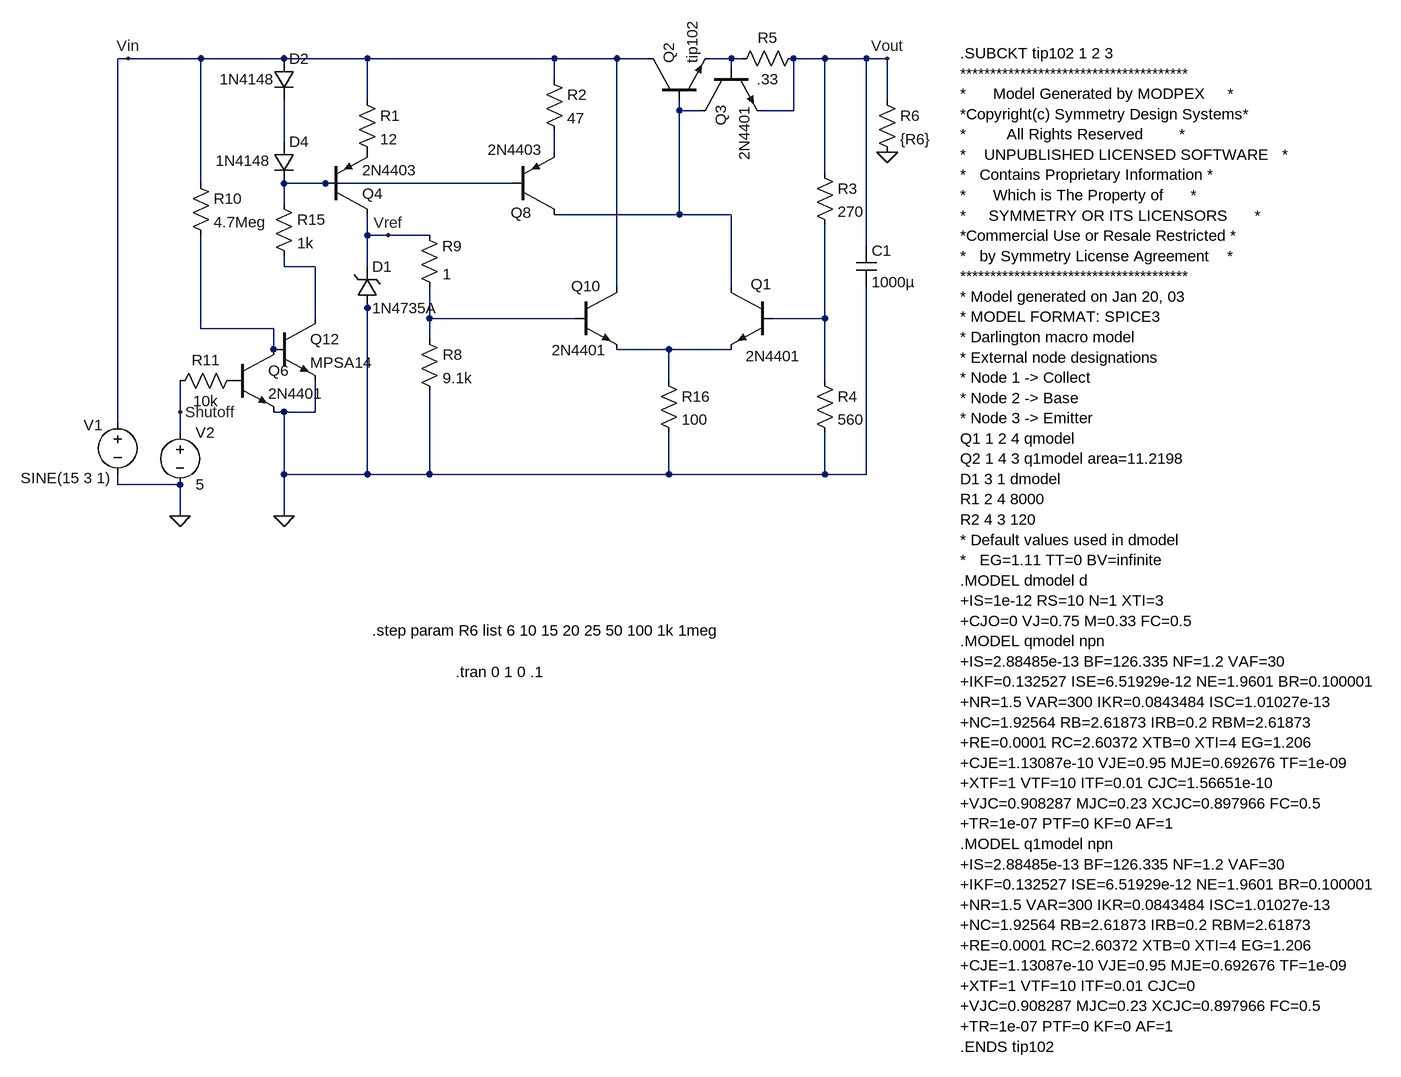
[diagram p0: schematic LPS.asc]
LPS.asc, the LTspice schematic file:
Version 4
SHEET 1 2016 1524
WIRE -640 -48 -656 -48
WIRE -528 -48 -640 -48
WIRE -400 -48 -528 -48
WIRE -272 -48 -400 -48
WIRE 16 -48 -272 -48
WIRE 112 -48 16 -48
WIRE 160 -48 112 -48
WIRE 288 -48 256 -48
WIRE 304 -48 288 -48
WIRE 432 -48 384 -48
WIRE 496 -48 432 -48
WIRE 528 -48 496 -48
WIRE 288 -32 288 -48
WIRE 16 -16 16 -48
WIRE -272 16 -272 -48
WIRE 528 16 528 -48
WIRE 208 32 208 16
WIRE 240 32 208 32
WIRE 384 32 384 -48
WIRE 384 32 336 32
WIRE -400 80 -400 16
WIRE 16 96 16 64
WIRE 432 128 432 -48
WIRE -528 144 -528 -48
WIRE -336 144 -400 144
WIRE -48 144 -336 144
WIRE -400 176 -400 144
WIRE 208 192 208 32
WIRE 208 192 16 192
WIRE 288 192 208 192
WIRE -272 224 -272 192
WIRE -240 224 -272 224
WIRE -176 224 -240 224
WIRE 496 240 496 -48
WIRE -400 272 -400 256
WIRE -352 272 -400 272
WIRE -272 272 -272 224
WIRE 112 304 112 -48
WIRE 288 304 288 192
WIRE -272 336 -272 320
WIRE -352 352 -352 272
WIRE -176 352 -176 304
WIRE 48 352 -176 352
WIRE 432 352 432 208
WIRE 432 352 352 352
WIRE -528 368 -528 224
WIRE -416 368 -528 368
WIRE -176 384 -176 352
WIRE -416 400 -416 368
WIRE 192 400 112 400
WIRE 288 400 192 400
WIRE 192 448 192 400
WIRE 432 448 432 352
WIRE -560 496 -560 448
WIRE -400 496 -416 496
WIRE -352 496 -352 448
WIRE -352 496 -400 496
WIRE -656 512 -656 -48
WIRE -560 528 -560 496
WIRE -400 592 -400 496
WIRE -272 592 -272 336
WIRE -272 592 -400 592
WIRE -176 592 -176 464
WIRE -176 592 -272 592
WIRE 192 592 192 528
WIRE 192 592 -176 592
WIRE 432 592 432 528
WIRE 432 592 192 592
WIRE 496 592 496 304
WIRE 496 592 432 592
WIRE -656 608 -656 592
WIRE -560 608 -656 608
WIRE -560 656 -560 608
WIRE -400 656 -400 592
FLAG -640 -48 Vin
FLAG 528 -48 Vout
FLAG -240 224 Vref
FLAG -560 656 0
FLAG 528 96 0
FLAG -400 656 0
FLAG -560 496 Shutoff
SYMBOL zener -288 336 M180
WINDOW 0 24 64 Left 2
WINDOW 3 24 0 Left 2
SYMATTR InstName D1
SYMATTR Value 1N4735A
SYMBOL npn 352 304 M0
WINDOW 0 2 -5 Left 2
WINDOW 3 -43 106 Left 2
SYMATTR InstName Q1
SYMATTR Value 2N4401
SYMBOL res 416 112 R0
SYMATTR InstName R3
SYMATTR Value 270
SYMBOL res 416 432 R0
SYMATTR InstName R4
SYMATTR Value 560
SYMBOL npn 160 16 R270
SYMATTR InstName Q2
SYMATTR Value tip102
SYMATTR Prefix X
SYMBOL voltage -656 496 R0
WINDOW 123 0 0 Left 2
WINDOW 39 0 0 Left 2
WINDOW 0 -52 20 Left 2
WINDOW 3 -149 102 Left 2
SYMATTR InstName V1
SYMATTR Value SINE(15 3 1)
SYMBOL res 400 -64 R90
WINDOW 0 0 56 VBottom 2
WINDOW 3 32 56 VTop 2
SYMATTR InstName R5
SYMATTR Value .33
SYMBOL npn 240 -32 M90
SYMATTR InstName Q3
SYMATTR Value 2N4401
SYMBOL res 512 0 R0
SYMATTR InstName R6
SYMATTR Value {R6}
SYMBOL diode -416 -48 R0
WINDOW 3 -83 32 Left 2
SYMATTR Value 1N4148
SYMATTR InstName D2
SYMBOL diode -416 80 R0
WINDOW 3 -89 29 Left 2
SYMATTR Value 1N4148
SYMATTR InstName D4
SYMBOL pnp -336 192 M180
SYMATTR InstName Q4
SYMATTR Value 2N4403
SYMBOL res -288 0 R0
SYMATTR InstName R1
SYMATTR Value 12
SYMBOL res -192 368 R0
SYMATTR InstName R8
SYMATTR Value 9.1k
SYMBOL res -192 208 R0
WINDOW 0 35 33 Left 2
SYMATTR InstName R9
SYMATTR Value 1
SYMBOL voltage -560 512 R0
WINDOW 123 0 0 Left 2
WINDOW 39 0 0 Left 2
SYMATTR InstName V2
SYMATTR Value 5
SYMBOL pnp -48 192 M180
WINDOW 0 -3 3 Left 2
WINDOW 3 -39 100 Left 2
SYMATTR InstName Q8
SYMATTR Value 2N4403
SYMBOL res 0 -32 R0
SYMATTR InstName R2
SYMATTR Value 47
SYMBOL npn 48 304 R0
WINDOW 0 -6 -2 Left 2
WINDOW 3 -36 97 Left 2
SYMATTR InstName Q10
SYMATTR Value 2N4401
SYMBOL npn -480 400 R0
SYMATTR InstName Q6
SYMATTR Value 2N4401
SYMBOL npn -416 352 R0
SYMATTR InstName Q12
SYMATTR Value MPSA14
SYMBOL res -544 128 R0
SYMATTR InstName R10
SYMATTR Value 4.7Meg
SYMBOL res -464 432 R90
WINDOW 0 0 56 VBottom 2
WINDOW 3 32 56 VTop 2
SYMATTR InstName R11
SYMATTR Value 10k
SYMBOL res -416 160 R0
SYMATTR InstName R15
SYMATTR Value 1k
SYMBOL res 176 432 R0
SYMATTR InstName R16
SYMATTR Value 100
SYMBOL cap 480 240 R0
SYMATTR InstName C1
SYMATTR Value 1000µ
TEXT -136 896 Left 2 !.tran 0 1 0 .1
TEXT 640 -56 Left 2 !.SUBCKT tip102 1 2 3\n**************************************\n*      Model Generated by MODPEX     *\n*Copyright(c) Symmetry Design Systems*\n*         All Rights Reserved        *\n*    UNPUBLISHED LICENSED SOFTWARE   *\n*   Contains Proprietary Information *\n*      Which is The Property of      *\n*     SYMMETRY OR ITS LICENSORS      *\n*Commercial Use or Resale Restricted *\n*   by Symmetry License Agreement    *\n**************************************\n* Model generated on Jan 20, 03\n* MODEL FORMAT: SPICE3\n* Darlington macro model\n* External node designations\n* Node 1 -> Collect\n* Node 2 -> Base\n* Node 3 -> Emitter\nQ1 1 2 4 qmodel\nQ2 1 4 3 q1model area=11.2198\nD1 3 1 dmodel\nR1 2 4 8000\nR2 4 3 120\n* Default values used in dmodel\n*   EG=1.11 TT=0 BV=infinite\n.MODEL dmodel d\n+IS=1e-12 RS=10 N=1 XTI=3\n+CJO=0 VJ=0.75 M=0.33 FC=0.5\n.MODEL qmodel npn\n+IS=2.88485e-13 BF=126.335 NF=1.2 VAF=30\n+IKF=0.132527 ISE=6.51929e-12 NE=1.9601 BR=0.100001\n+NR=1.5 VAR=300 IKR=0.0843484 ISC=1.01027e-13\n+NC=1.92564 RB=2.61873 IRB=0.2 RBM=2.61873\n+RE=0.0001 RC=2.60372 XTB=0 XTI=4 EG=1.206\n+CJE=1.13087e-10 VJE=0.95 MJE=0.692676 TF=1e-09\n+XTF=1 VTF=10 ITF=0.01 CJC=1.56651e-10\n+VJC=0.908287 MJC=0.23 XCJC=0.897966 FC=0.5\n+TR=1e-07 PTF=0 KF=0 AF=1\n.MODEL q1model npn\n+IS=2.88485e-13 BF=126.335 NF=1.2 VAF=30\n+IKF=0.132527 ISE=6.51929e-12 NE=1.9601 BR=0.100001\n+NR=1.5 VAR=300 IKR=0.0843484 ISC=1.01027e-13\n+NC=1.92564 RB=2.61873 IRB=0.2 RBM=2.61873\n+RE=0.0001 RC=2.60372 XTB=0 XTI=4 EG=1.206\n+CJE=1.13087e-10 VJE=0.95 MJE=0.692676 TF=1e-09\n+XTF=1 VTF=10 ITF=0.01 CJC=0\n+VJC=0.908287 MJC=0.23 XCJC=0.897966 FC=0.5\n+TR=1e-07 PTF=0 KF=0 AF=1\n.ENDS tip102
TEXT -264 832 Left 2 !.step param R6 list 6 10 15 20 25 50 100 1k 1meg

The netlist it stands for:
* LPS.asc
D1 0 Vref 1N4735A
Q1 N002 N008 N010 0 2N4401
R3 Vout N008 270
R4 N008 0 560
XQ2 Vin N002 N001 tip102  ; pins C B E
V1 Vin 0 SINE(15 3 1)
R5 Vout N001 .33
Q3 N002 N001 Vout 0 2N4401
R6 Vout 0 {R6}
D2 Vin N003 1N4148
D4 N003 N005 1N4148
Q4 Vref N005 P001 0 2N4403
R1 Vin P001 12
R8 N007 0 9.1k
R9 Vref N007 1
V2 Shutoff 0 5
Q8 N002 N005 N004 0 2N4403
R2 Vin N004 47
Q10 Vin N007 N010 0 2N4401
Q6 N009 P002 0 0 2N4401
Q12 N006 N009 0 0 MPSA14
R10 Vin N009 4.7Meg
R11 P002 Shutoff 10k
R15 N005 N006 1k
R16 N010 0 100
C1 Vout 0 1000µ
.model D D
.lib standard.dio
.model NPN NPN
.model PNP PNP
.lib standard.bjt
.tran 0 1 0 .1
.SUBCKT tip102 1 2 3
**************************************
*      Model Generated by MODPEX     *
*Copyright(c) Symmetry Design Systems*
*         All Rights Reserved        *
*    UNPUBLISHED LICENSED SOFTWARE   *
*   Contains Proprietary Information *
*      Which is The Property of      *
*     SYMMETRY OR ITS LICENSORS      *
*Commercial Use or Resale Restricted *
*   by Symmetry License Agreement    *
**************************************
* Model generated on Jan 20, 03
* MODEL FORMAT: SPICE3
* Darlington macro model
* External node designations
* Node 1 -> Collect
* Node 2 -> Base
* Node 3 -> Emitter
Q1 1 2 4 qmodel
Q2 1 4 3 q1model area=11.2198
D1 3 1 dmodel
R1 2 4 8000
R2 4 3 120
* Default values used in dmodel
*   EG=1.11 TT=0 BV=infinite
.MODEL dmodel d
+IS=1e-12 RS=10 N=1 XTI=3
+CJO=0 VJ=0.75 M=0.33 FC=0.5
.MODEL qmodel npn
+IS=2.88485e-13 BF=126.335 NF=1.2 VAF=30
+IKF=0.132527 ISE=6.51929e-12 NE=1.9601 BR=0.100001
+NR=1.5 VAR=300 IKR=0.0843484 ISC=1.01027e-13
+NC=1.92564 RB=2.61873 IRB=0.2 RBM=2.61873
+RE=0.0001 RC=2.60372 XTB=0 XTI=4 EG=1.206
+CJE=1.13087e-10 VJE=0.95 MJE=0.692676 TF=1e-09
+XTF=1 VTF=10 ITF=0.01 CJC=1.56651e-10
+VJC=0.908287 MJC=0.23 XCJC=0.897966 FC=0.5
+TR=1e-07 PTF=0 KF=0 AF=1
.MODEL q1model npn
+IS=2.88485e-13 BF=126.335 NF=1.2 VAF=30
+IKF=0.132527 ISE=6.51929e-12 NE=1.9601 BR=0.100001
+NR=1.5 VAR=300 IKR=0.0843484 ISC=1.01027e-13
+NC=1.92564 RB=2.61873 IRB=0.2 RBM=2.61873
+RE=0.0001 RC=2.60372 XTB=0 XTI=4 EG=1.206
+CJE=1.13087e-10 VJE=0.95 MJE=0.692676 TF=1e-09
+XTF=1 VTF=10 ITF=0.01 CJC=0
+VJC=0.908287 MJC=0.23 XCJC=0.897966 FC=0.5
+TR=1e-07 PTF=0 KF=0 AF=1
.ENDS tip102
.step param R6 list 6 10 15 20 25 50 100 1k 1meg
.backanno
.end